# Altium schematic sheet Plata_Perehodnaya.SchDoc
size 420 x 297 mm; SheetNumber: 1; SheetTotal: 1
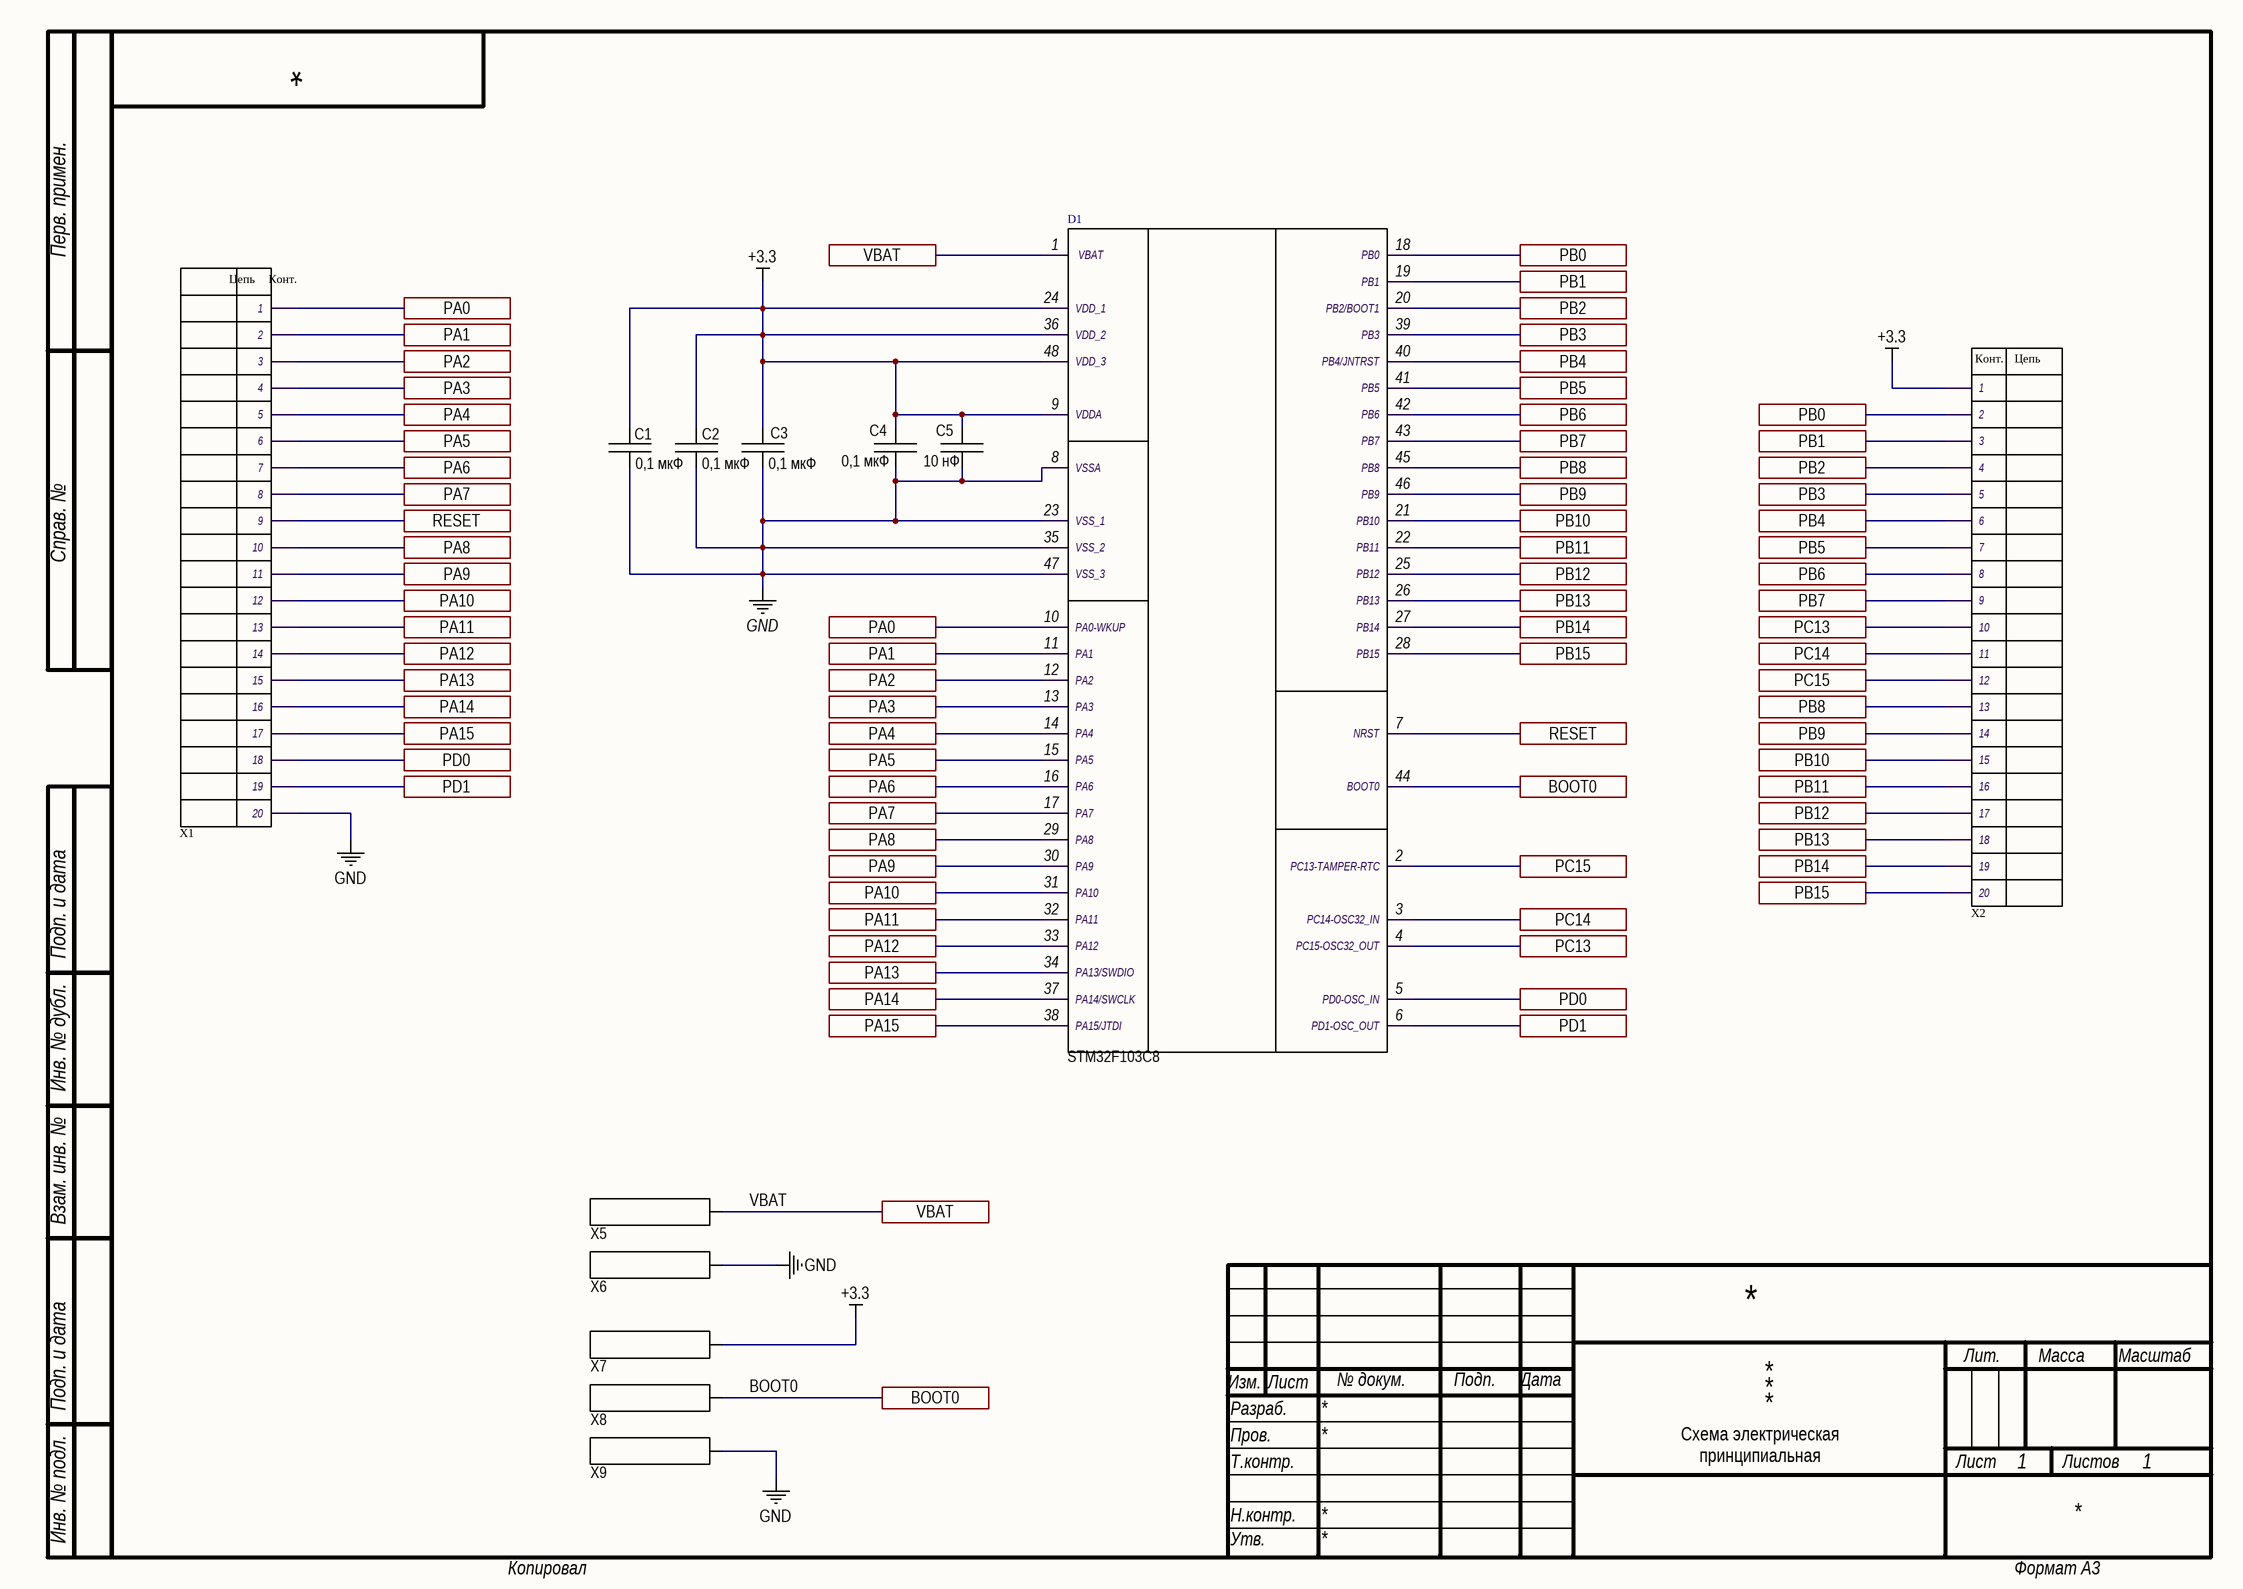
[diagram p0: Plata_Perehodnaya.SchDoc]

## Parts
C1  0,1 мкФ  [C0805]
C2  0,1 мкФ  [C0805]
C3  0,1 мкФ  [C0805]
C4  0,1 мкФ  [C0805]
C5  10 нФ  [C0805]
D1  STM32F103C8  [48-LQFP (7x7)]
X1  *  [PLS-20 (DS-1021-1x20)]  (value not drawn)
X2  *  [PLS-20 (DS-1021-1x20)]  (value not drawn)
X5  Стыковка  [Стыковка]  (value not drawn)
X6  Стыковка  [Стыковка]  (value not drawn)
X7  Стыковка  [Стыковка]  (value not drawn)
X8  Стыковка  [Стыковка]  (value not drawn)
X9  Стыковка  [Стыковка]  (value not drawn)

## Ports
BOOT0, PA0, PA1, PA2, PA3, PA4, PA5, PA6, PA7, PA8, PA9, PA10, PA11, PA12, PA13, PA14, PA15, PB0, PB1, PB2, PB3, PB4, PB5, PB6, PB7, PB8, PB9, PB10, PB11, PB12, PB13, PB14, PB15, PC13, PC14, PC15, PD0, PD1, RESET, VBAT

## Nets
+3.3: C1.1 C2.1 C3.1 C4.1 C5.1 D1.9(VDDA) D1.24(VDD_1) D1.36(VDD_2) D1.48(VDD_3) X2.1 X7.1
GND: C1.2 C2.2 C3.2 C4.2 C5.2 D1.8(VSSA) D1.23(VSS_1) D1.35(VSS_2) D1.47(VSS_3) X1.20 X6.1 X9.1
BOOT0: D1.44(BOOT0) X8.1 ; port BOOT0
PA0: D1.10(PA0-WKUP) X1.1 ; port PA0
PA1: D1.11(PA1) X1.2 ; port PA1
PA2: D1.12(PA2) X1.3 ; port PA2
PA3: D1.13(PA3) X1.4 ; port PA3
PA4: D1.14(PA4) X1.5 ; port PA4
PA5: D1.15(PA5) X1.6 ; port PA5
PA6: D1.16(PA6) X1.7 ; port PA6
PA7: D1.17(PA7) X1.8 ; port PA7
PA8: D1.29(PA8) X1.10 ; port PA8
PA9: D1.30(PA9) X1.11 ; port PA9
PA10: D1.31(PA10) X1.12 ; port PA10
PA11: D1.32(PA11) X1.13 ; port PA11
PA12: D1.33(PA12) X1.14 ; port PA12
PA13: D1.34(PA13/SWDIO) X1.15 ; port PA13
PA14: D1.37(PA14/SWCLK) X1.16 ; port PA14
PA15: D1.38(PA15/JTDI) X1.17 ; port PA15
PB0: D1.18(PB0) X2.2 ; port PB0
PB1: D1.19(PB1) X2.3 ; port PB1
PB2: D1.20(PB2/BOOT1) X2.4 ; port PB2
PB3: D1.39(PB3) X2.5 ; port PB3
PB4: D1.40(PB4/JNTRST) X2.6 ; port PB4
PB5: D1.41(PB5) X2.7 ; port PB5
PB6: D1.42(PB6) X2.8 ; port PB6
PB7: D1.43(PB7) X2.9 ; port PB7
PB8: D1.45(PB8) X2.13 ; port PB8
PB9: D1.46(PB9) X2.14 ; port PB9
PB10: D1.21(PB10) X2.15 ; port PB10
PB11: D1.22(PB11) X2.16 ; port PB11
PB12: D1.25(PB12) X2.17 ; port PB12
PB13: D1.26(PB13) X2.18 ; port PB13
PB14: D1.27(PB14) X2.19 ; port PB14
PB15: D1.28(PB15) X2.20 ; port PB15
PC13: D1.4(PC15-OSC32_OUT) X2.10 ; port PC13
PC14: D1.3(PC14-OSC32_IN) X2.11 ; port PC14
PC15: D1.2(PC13-TAMPER-RTC) X2.12 ; port PC15
PD0: D1.5(PD0-OSC_IN) X1.18 ; port PD0
PD1: D1.6(PD1-OSC_OUT) X1.19 ; port PD1
RESET: D1.7(NRST) X1.9 ; port RESET
VBAT: D1.1(VBAT) X5.1 ; port VBAT

## Notes on the sheet
- Перв. примен.
- Справ. №
- Подп. и дата
- Инв. № дубл.
- Взам. инв. №
- Изм.
- Разраб.
- Лист
- № докум.
- Подп.
- Дата
- Лит.
- Масса
- Масштаб
- Пров.
- Т.контр.
- Схема электрическая
  принципиальная
- Листов
- Инв. № подл.
- Н.контр.
- Утв.
- Копировал
- Формат А3
- (in symbol Разъемы на плате-20) Конт.; Цепь

## Library data of the parts
C1-C4 = Capacity: 0.1 µF ±10% 50V Ceramic Capacitor X7R 0805 (2012 Metric); Manufacture: Murata Electronics; Model: GRM21BR71H104KA01L; Name: Конденсатор; Case: 0805; Value: 0,1 мкФ
  C1-C3: HelpURL: https://www.digikey.com/en/products/detail/murata-electronics/GRM21BR71H104KA01L/586718?s=N4IgTCBcDaIOICUCyYCMAhBB2VAJVADACwDSAggagDYgC6AvkA
  C4: HelpURL: N4IgTCBcDaIOICUCyYCMAhBB2VAJVADACwDSAggagDYgC6AvkA
C5 = Capacity: ±5% 50V Ceramic Capacitor X7R 0805 (2012 Metric); Manufacture: Yageo; Model: CS0805JRX7R9BB103; Name: Конденсатор; HelpURL: https://www.digikey.com/en/products/detail/yageo/CS0805JRX7R9BB103/6097936; Case: 0805; Value: 10 нФ
D1 = STM32F103C8T6: Manufacture: STMicroelectronics; Name: Микроконтроллер; Case: 48-LQFP; HelpURL: https://www.digikey.com/product-detail/en/stmicroelectronics/STM32F103C8T7TR/STM32F103C8T7TR-ND/5268214; Model: STM32F103C8T; Value: STM32F103C8
X1 X2 = Разъемы на плате-20: Name: Разъем; Case: *; Manufacture: *; HelpURL: *; Model: *; Value: *; Конт.11: *; Конт.1: *; Конт.10: *; Конт.2: *; Конт.4: *; Конт.3: *; Конт.5: *; Конт.8: *; Конт.6: *; Конт.7: *; Конт.9: *; Конт.12: *
X5-X9 = Стыковка: Связь: *